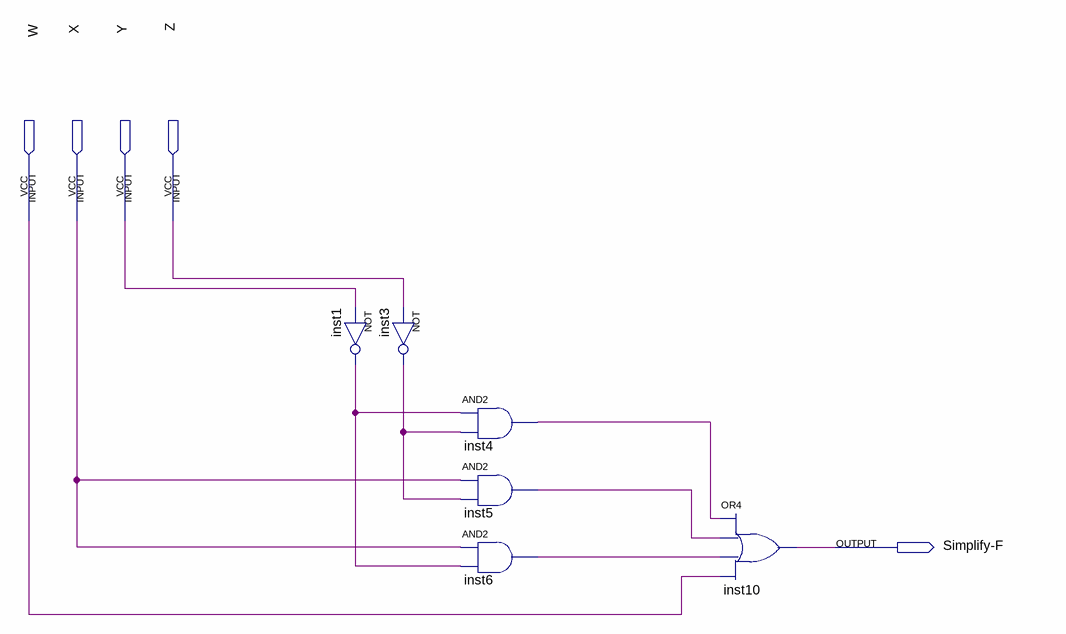
[diagram p0: schematic sheet]
// Quartus schematic Simplify-F.bdf as structural Verilog: 6 symbols, 5 pins
module \Simplify-F  (
  input  W,
  input  X,
  input  Y,
  input  Z,
  output \Simplify-F 
);

  wire inst1_out, inst3_out, inst4_out, inst5_out, inst6_out;

  not inst1 (inst1_out, Y);
  not inst3 (inst3_out, Z);
  and inst4 (inst4_out, inst1_out, inst3_out);
  and inst5 (inst5_out, X, inst3_out);
  and inst6 (inst6_out, X, inst1_out);
  or inst10 (\Simplify-F , inst4_out, inst5_out, inst6_out, W);
endmodule
